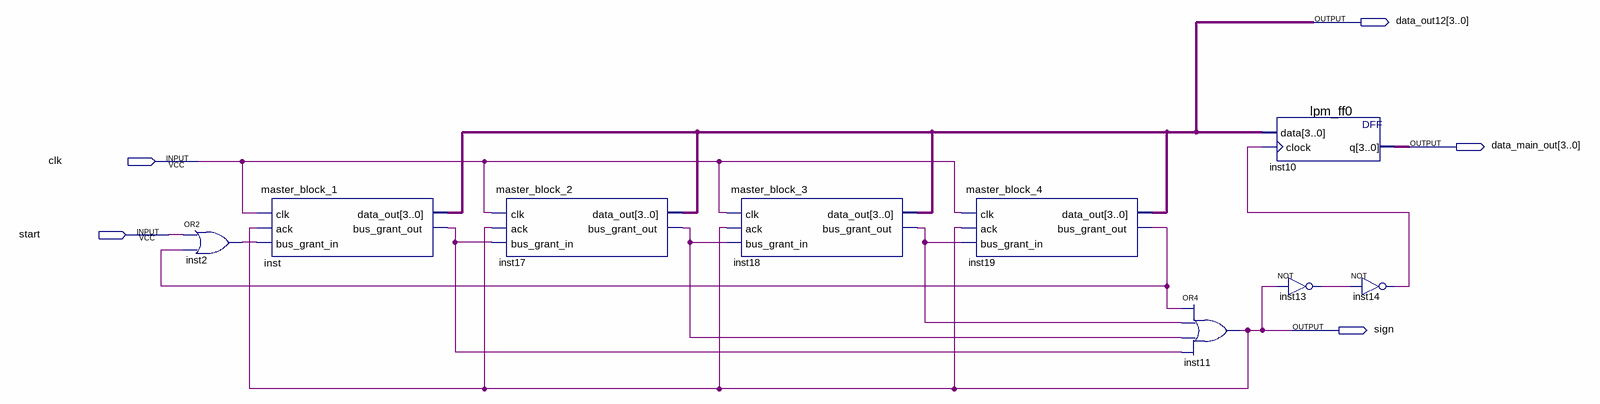
[diagram p0: schematic sheet]
// Quartus schematic laba7_var1.bdf as structural Verilog: 9 symbols, 5 pins
module laba7_var1 (
  input  clk,
  input  start,
  output [3:0] data_out12,
  output [3:0] data_main_out,
  output sign
);

  wire inst2_out, inst13_out, inst14_out, inst17_bus_grant_out, inst18_bus_grant_out, inst19_bus_grant_out,
       inst_bus_grant_out;

  or inst2 (inst2_out, start, inst19_bus_grant_out);
  master_block_1 inst (
    .clk(clk), .ack(sign), .bus_grant_in(inst2_out), .data_out(data_out12), .bus_grant_out(inst_bus_grant_out));
  master_block_2 inst17 (
    .clk(clk), .ack(sign), .bus_grant_in(inst_bus_grant_out), .data_out(data_out12),
    .bus_grant_out(inst17_bus_grant_out));
  master_block_3 inst18 (
    .clk(clk), .ack(sign), .bus_grant_in(inst17_bus_grant_out), .data_out(data_out12),
    .bus_grant_out(inst18_bus_grant_out));
  master_block_4 inst19 (
    .clk(clk), .ack(sign), .bus_grant_in(inst18_bus_grant_out), .data_out(data_out12),
    .bus_grant_out(inst19_bus_grant_out));
  or inst11 (sign, inst19_bus_grant_out, inst18_bus_grant_out, inst17_bus_grant_out, inst_bus_grant_out);
  lpm_ff0 inst10 (.data(data_out12), .clock(inst14_out), .q(data_main_out));
  not inst13 (inst13_out, sign);
  not inst14 (inst14_out, inst13_out);
endmodule
